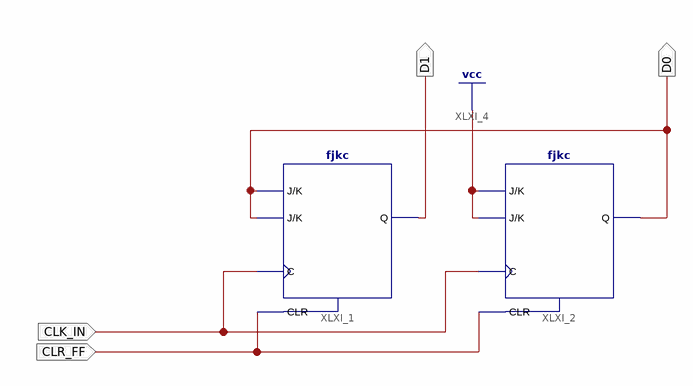
[diagram p0: schematic sheet 1]
// Xilinx ISE schematic Counter_Up_0_3.sch (spartan6) as structural Verilog: 2 symbols, 4 ports
module Counter_Up_0_3 (
  input  CLK_IN,
  input  CLR_FF,
  output D0,
  output D1
);

  fjkc XLXI_1 (.C(CLK_IN), .CLR(CLR_FF), .J(D0), .K(D0), .Q(D1));
  fjkc XLXI_2 (.C(CLK_IN), .CLR(CLR_FF), .J(1'b1), .K(1'b1), .Q(D0));
endmodule
